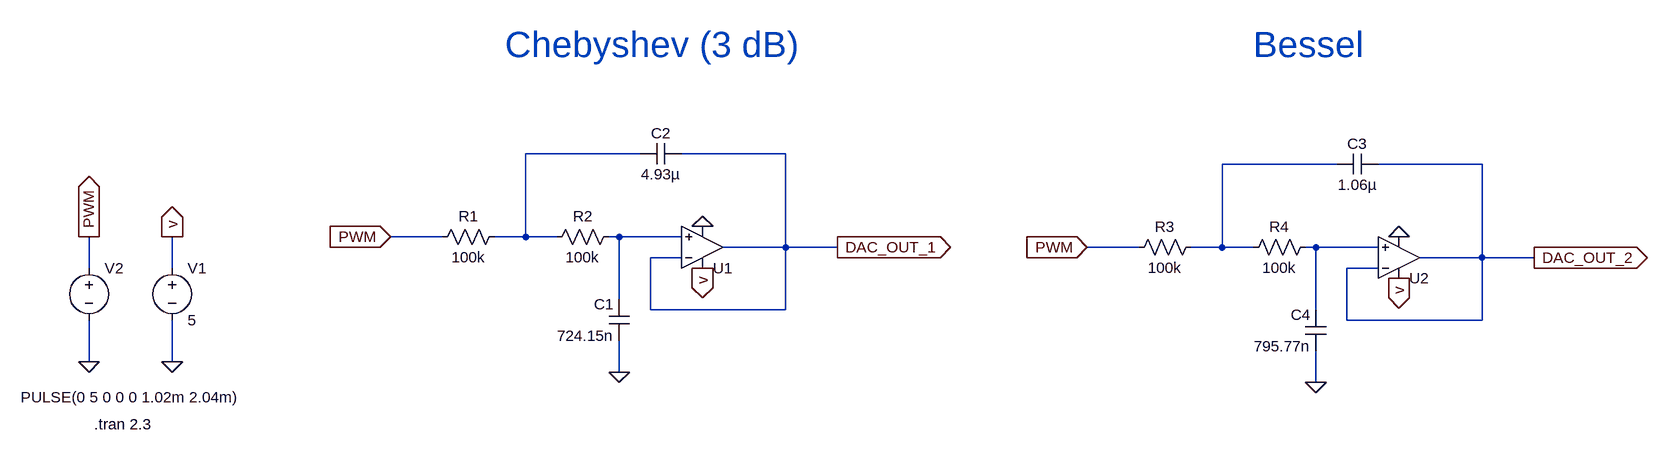
[diagram p0: schematic PWM-DAC.asc]
PWM-DAC.asc, the LTspice schematic file:
Version 4
SHEET 1 1928 680
WIRE 352 -208 176 -208
WIRE 576 -208 416 -208
WIRE 1424 -192 1248 -192
WIRE 1648 -192 1488 -192
WIRE 48 -80 -32 -80
WIRE 176 -80 176 -208
WIRE 176 -80 128 -80
WIRE 224 -80 176 -80
WIRE 320 -80 304 -80
WIRE 416 -80 320 -80
WIRE 576 -64 576 -208
WIRE 576 -64 480 -64
WIRE 656 -64 576 -64
WIRE 1120 -64 1040 -64
WIRE 1248 -64 1248 -192
WIRE 1248 -64 1200 -64
WIRE 1296 -64 1248 -64
WIRE 1392 -64 1376 -64
WIRE 1488 -64 1392 -64
WIRE 416 -48 368 -48
WIRE 1648 -48 1648 -192
WIRE 1648 -48 1552 -48
WIRE 1728 -48 1648 -48
WIRE -496 -32 -496 -80
WIRE -368 -32 -368 -80
WIRE 1488 -32 1440 -32
WIRE 320 16 320 -80
WIRE 368 32 368 -48
WIRE 576 32 576 -64
WIRE 576 32 368 32
WIRE 1392 32 1392 -64
WIRE 1440 48 1440 -32
WIRE 1648 48 1648 -48
WIRE 1648 48 1440 48
WIRE -496 112 -496 48
WIRE -368 112 -368 48
WIRE 320 128 320 80
WIRE 1392 144 1392 96
FLAG -368 112 0
FLAG -368 -80 v
IOPIN -368 -80 Out
FLAG 448 -32 v
IOPIN 448 -32 Out
FLAG 448 -96 0
FLAG 320 128 0
FLAG -496 112 0
FLAG -496 -80 PWM
IOPIN -496 -80 Out
FLAG -32 -80 PWM
IOPIN -32 -80 In
FLAG 656 -64 DAC_OUT_1
IOPIN 656 -64 Out
FLAG 1520 -16 v
IOPIN 1520 -16 Out
FLAG 1520 -80 0
FLAG 1392 144 0
FLAG 1040 -64 PWM
IOPIN 1040 -64 In
FLAG 1728 -48 DAC_OUT_2
IOPIN 1728 -48 Out
SYMBOL voltage -368 -48 R0
WINDOW 123 0 0 Left 0
WINDOW 39 0 0 Left 0
SYMATTR InstName V1
SYMATTR Value 5
SYMBOL OpAmps\\UniversalOpAmp2 448 -64 M180
SYMATTR InstName U1
SYMBOL res 144 -96 R90
WINDOW 0 0 56 VBottom 2
WINDOW 3 32 56 VTop 2
SYMATTR InstName R1
SYMATTR Value 100k
SYMBOL res 320 -96 R90
WINDOW 0 0 56 VBottom 2
WINDOW 3 32 56 VTop 2
SYMATTR InstName R2
SYMATTR Value 100k
SYMBOL cap 416 -224 R90
WINDOW 0 0 32 VBottom 2
WINDOW 3 32 32 VTop 2
SYMATTR InstName C2
SYMATTR Value 4.93µ
SYMBOL cap 336 80 R180
WINDOW 0 24 56 Left 2
WINDOW 3 24 8 Left 2
SYMATTR InstName C1
SYMATTR Value 724.15n
SYMBOL voltage -496 -48 R0
WINDOW 3 -105 215 Left 2
WINDOW 123 0 0 Left 0
WINDOW 39 0 0 Left 0
SYMATTR Value PULSE(0 5 0 0 0 1.02m 2.04m)
SYMATTR InstName V2
SYMBOL OpAmps\\UniversalOpAmp2 1520 -48 M180
SYMATTR InstName U2
SYMBOL res 1216 -80 R90
WINDOW 0 0 56 VBottom 2
WINDOW 3 32 56 VTop 2
SYMATTR InstName R3
SYMATTR Value 100k
SYMBOL res 1392 -80 R90
WINDOW 0 0 56 VBottom 2
WINDOW 3 32 56 VTop 2
SYMATTR InstName R4
SYMATTR Value 100k
SYMBOL cap 1488 -208 R90
WINDOW 0 0 32 VBottom 2
WINDOW 3 32 32 VTop 2
SYMATTR InstName C3
SYMATTR Value 1.06µ
SYMBOL cap 1408 96 R180
WINDOW 0 24 56 Left 2
WINDOW 3 24 8 Left 2
SYMATTR InstName C4
SYMATTR Value 795.77n
TEXT -488 208 Left 2 !.tran 2.3
TEXT 144 -376 Left 5 ;Chebyshev (3 dB)
TEXT 1296 -376 Left 5 ;Bessel

The netlist it stands for:
* PWM-DAC.asc
V1 v 0 5
XU1 N003 DAC_OUT_1 v 0 DAC_OUT_1 level2 Avol=1Meg GBW=10Meg Slew=10Meg Ilimit=25m Rail=0 Vos=0 En=0 Enk=0 In=0 Ink=0 Rin=500Meg  ; pins In+ In- V+ V- OUT
R1 N001 PWM 100k
R2 N003 N001 100k
C2 DAC_OUT_1 N001 4.93µ
C1 0 N003 724.15n
V2 PWM 0 PULSE(0 5 0 0 0 1.02m 2.04m)
XU2 N004 DAC_OUT_2 v 0 DAC_OUT_2 level2 Avol=1Meg GBW=10Meg Slew=10Meg Ilimit=25m Rail=0 Vos=0 En=0 Enk=0 In=0 Ink=0 Rin=500Meg  ; pins In+ In- V+ V- OUT
R3 N002 PWM 100k
R4 N004 N002 100k
C3 DAC_OUT_2 N002 1.06µ
C4 0 N004 795.77n
.tran 2.3
* Chebyshev (3 dB)
* Bessel
.lib UniversalOpAmp2.lib
.backanno
.end